# EAGLE schematic smarty07 (EAGLE 6.5.0)
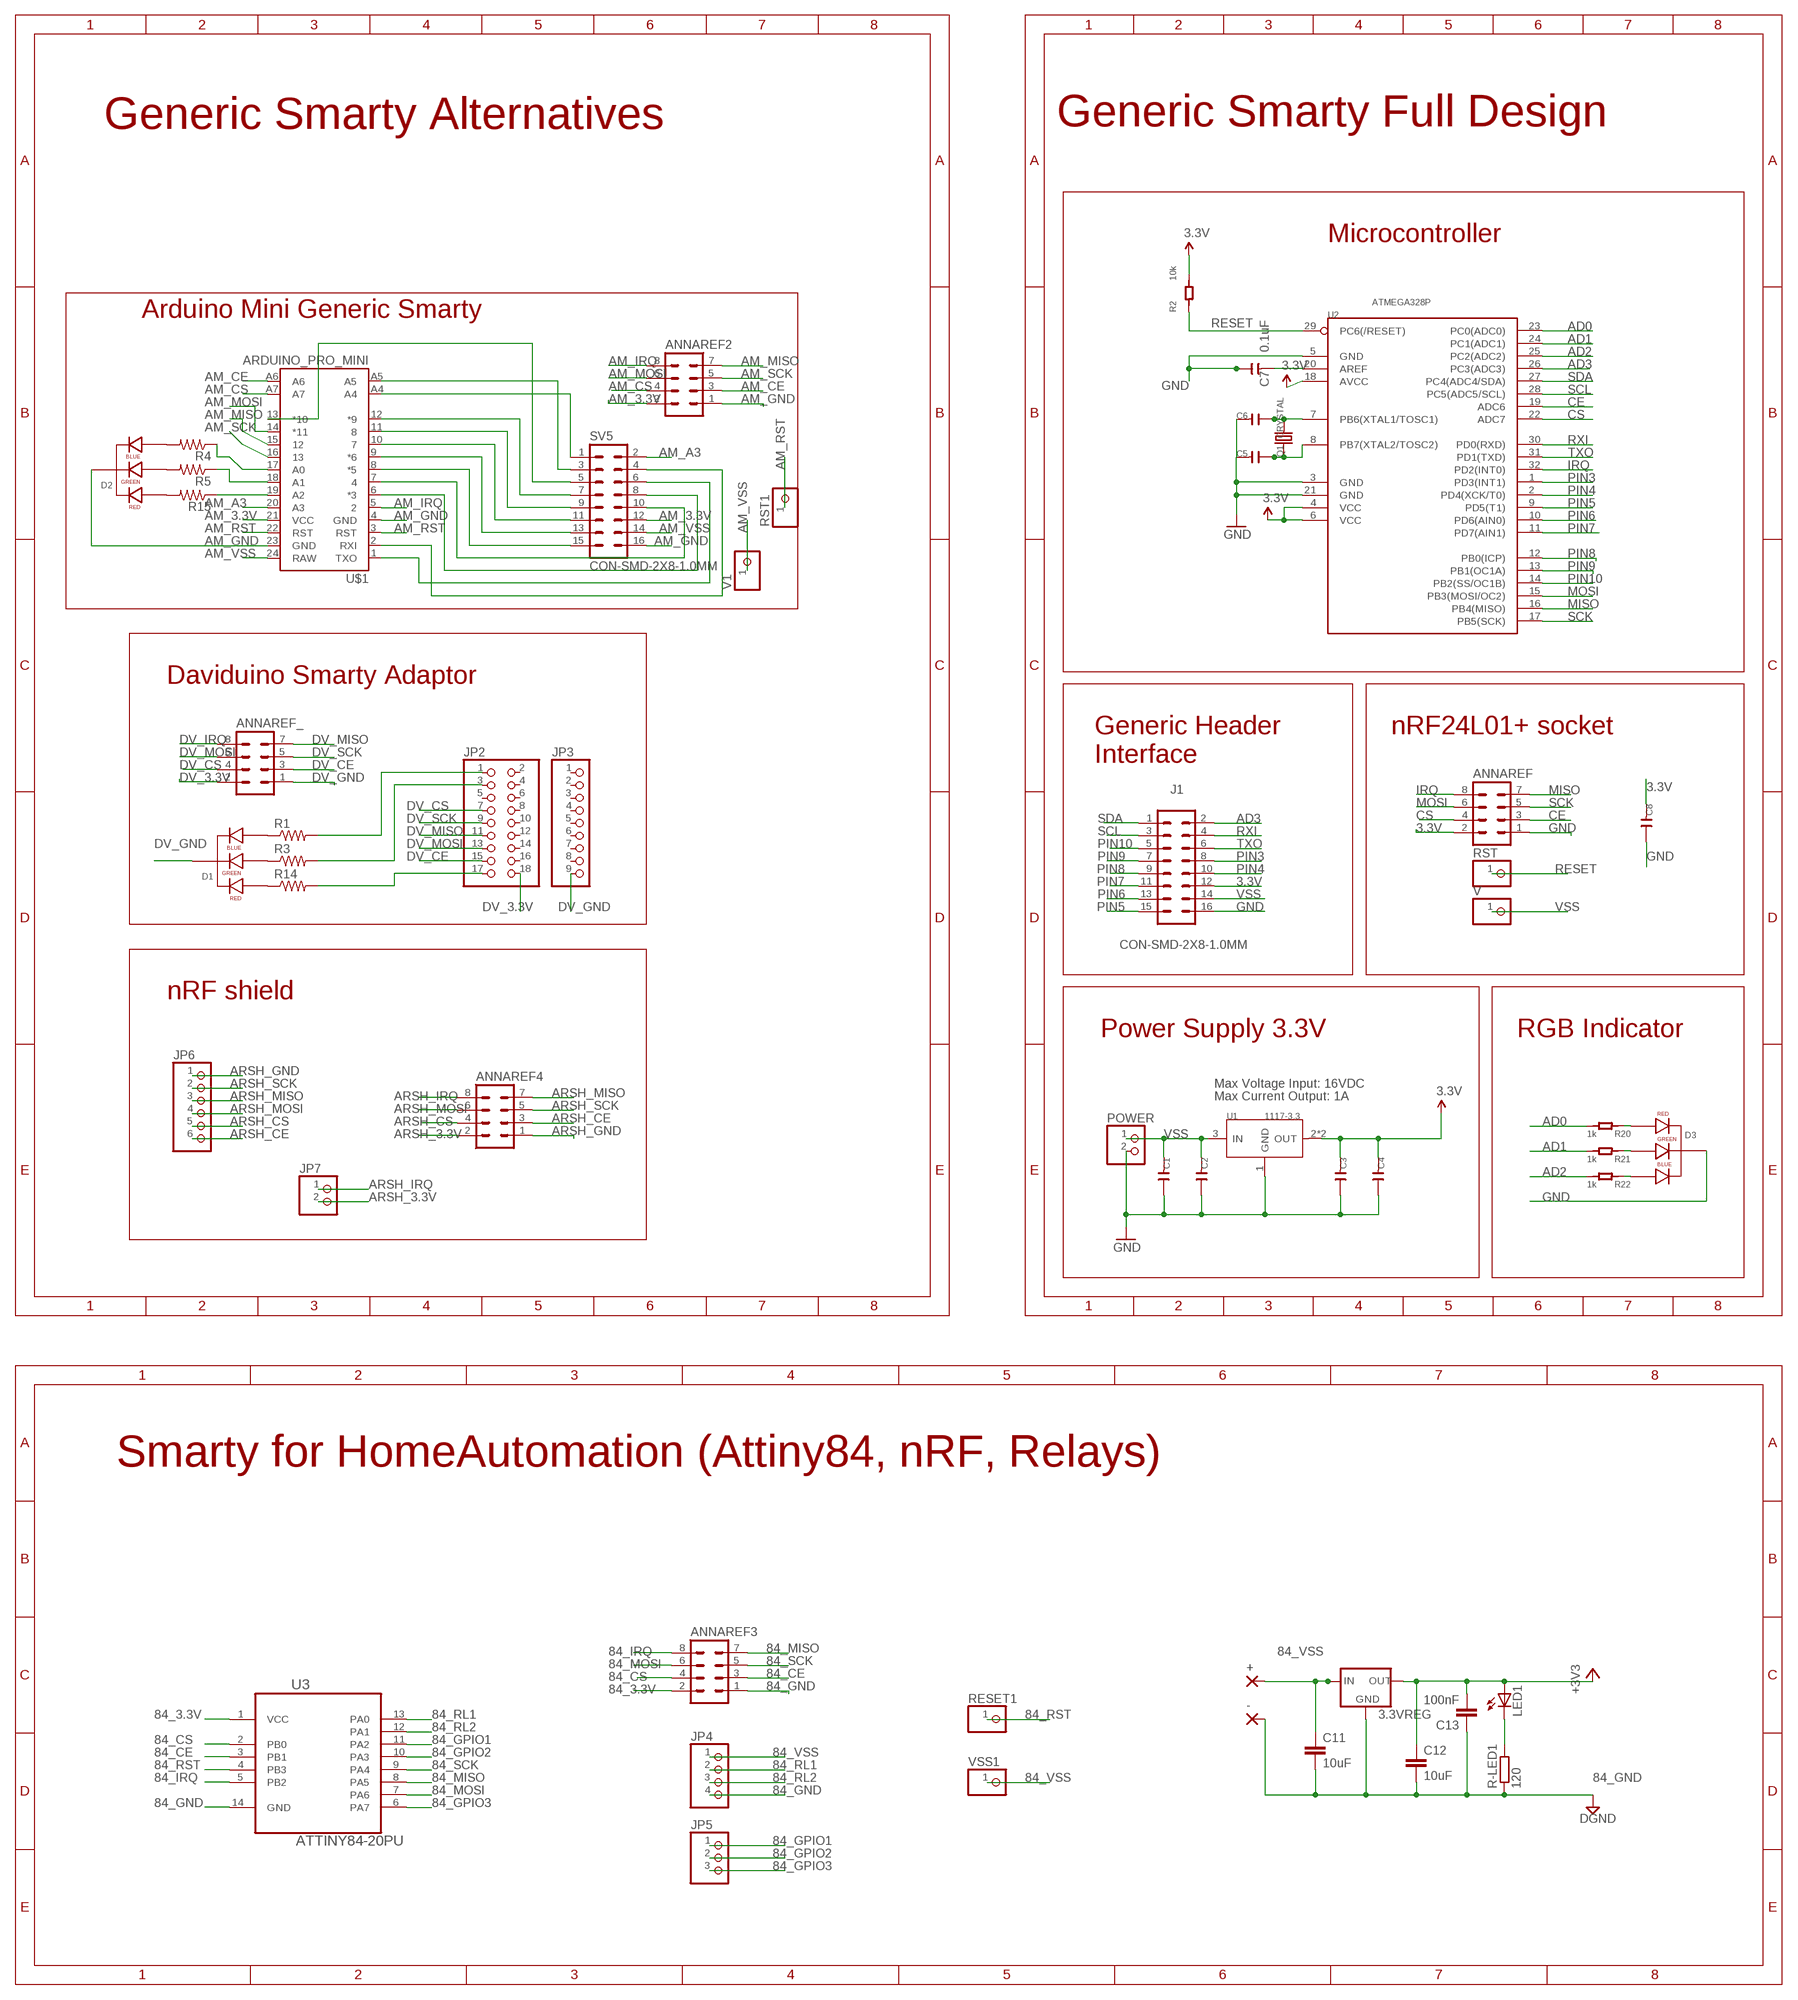
[diagram p0: schematic, sheet 1, part 1 of 2]
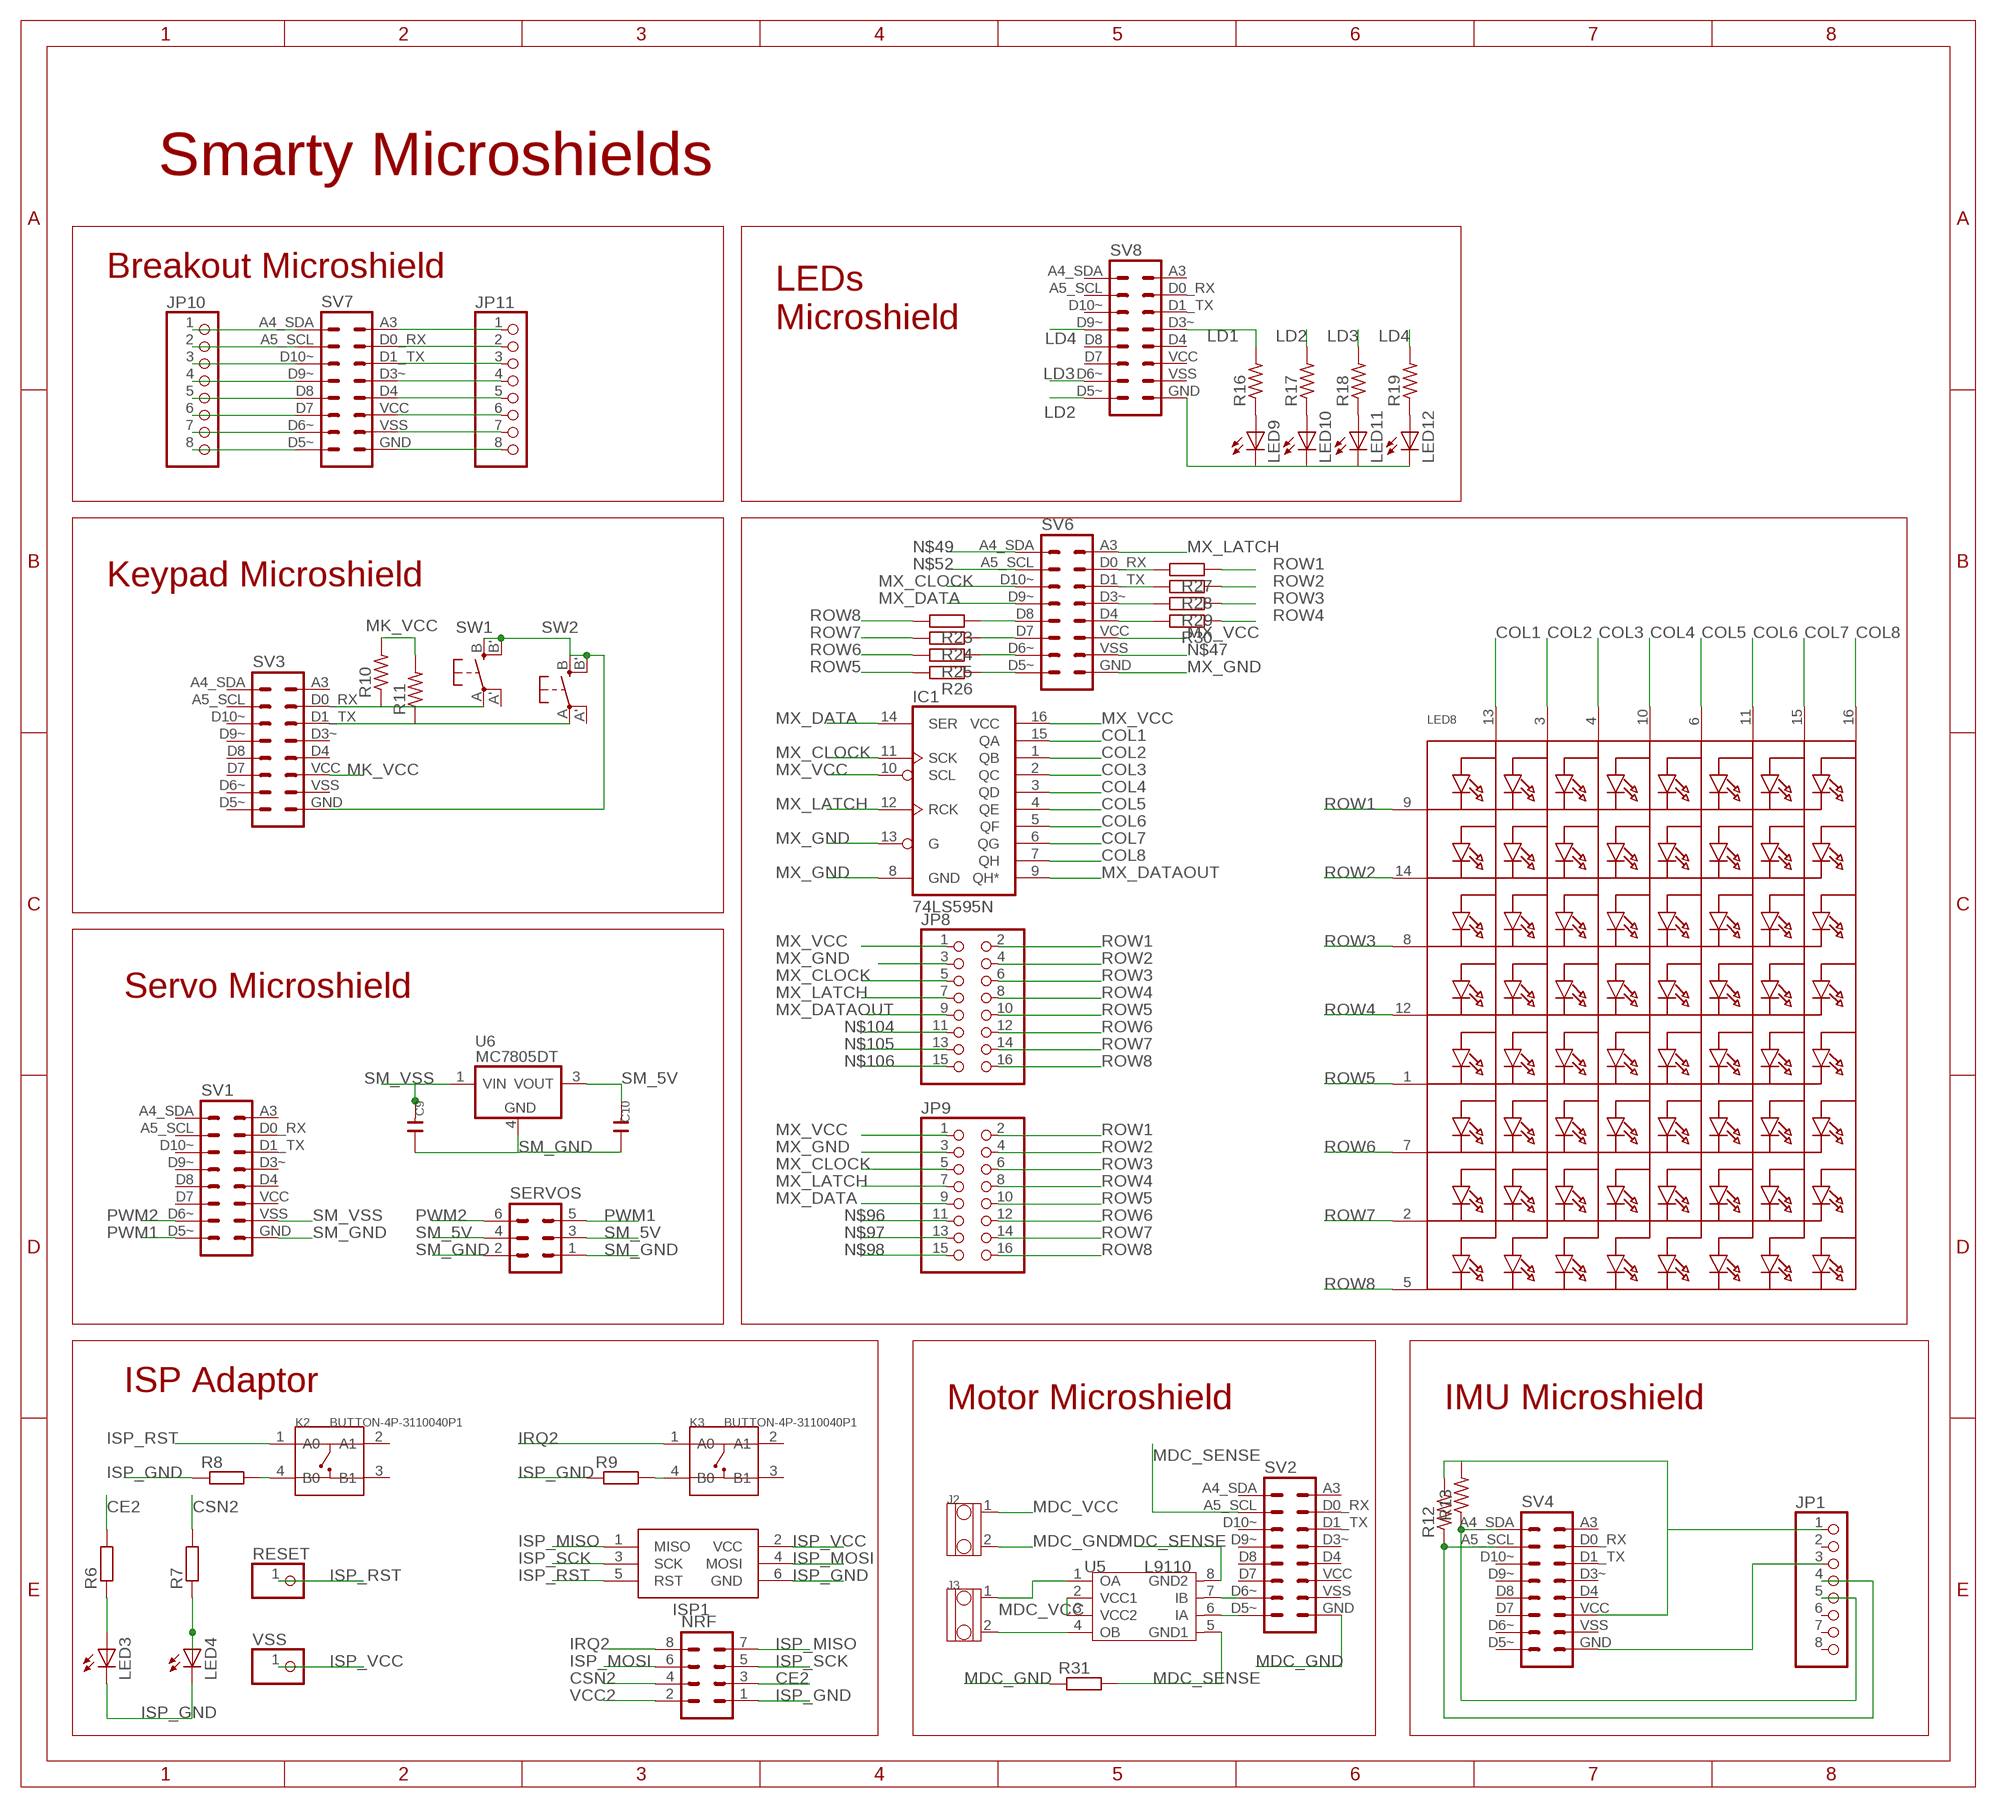
[diagram p1: schematic, sheet 1, part 2 of 2]

## Parts
3.3VREG  78LXX  [78LXX]
+  2,54/1,1  [2,54/1,1]
-  2,54/1,1  [2,54/1,1]
ANNAREF  MA04-2  [MA04-2]
ANNAREF2  MA04-2  [MA04-2]
ANNAREF3  MA04-2  [MA04-2]
ANNAREF4  MA04-2  [MA04-2]
ANNAREF_  MA04-2  [MA04-2]
C1  C-0603  [C0603]
C2  C-0805  [C0805]
C3  C-0603  [C0603]
C4  C-0805  [C0805]
C5  C-0603  [C0603]
C6  C-0603  [C0603]
C7  0.1uF  C-0805  [C0805]
C8  C-0805  [C0805]
C9  C-0805  [C0805]
C10  C-0805  [C0805]
C11  10uF  C-EU025-050X050  [C025-050X050]
C12  10uF  C-EU025-050X050  [C025-050X050]
C13  100nF  C-EU050-024X044  [C050-024X044]
D1  LED-RGB-CC-THRUCLEAR  [LED-RGB-THRU]
D2  LED-RGB-CC-THRUCLEAR  [LED-RGB-THRU]
D3  LED-RGB-CC-THRUCLEAR  [LED-RGB-THRU]
IC1  74LS595N  [DIL16]
ISP1  AVRISP-6  [AVRISP]
J1  CON-SMD-2X8-1.0MM  [SMRT-FEM-16]
J2  SCREW-TERMINAL-2P-3470110P1  [2P-5.0]
J3  SCREW-TERMINAL-2P-3470110P1  [2P-5.0]
JP1  PINHD-1X8BIG  [1X08-BIG]
JP2  PINHD-2X9-BIG  [2X09-BIG]
JP3  PINHD-1X9  [1X09-BIG]
JP4  PINHD-1X4  [1X04]
JP5  PINHD-1X3  [1X03]
JP6  PINHD-1X6  [1X06]
JP7  PINHD-1X2  [1X02]
JP8  PINHD-2X8  [2X08]
JP9  PINHD-2X8  [2X08]
JP10  PINHD-1X8  [1X08]
JP11  PINHD-1X8  [1X08]
K2  BUTTON-4P-3110040P1  [4P-6.0X6.0X5.0H]
K3  BUTTON-4P-3110040P1  [4P-6.0X6.0X5.0H]
LED1  LED3MM  [LED3MM]
LED3  LED3MM  [LED3MM]
LED4  LED3MM  [LED3MM]
LED8  SEGMENT_8X8_ROWCATHODEM12A881UR  [SEGMENT_BL-M12A881UR]
LED9  LEDCHIP-LED0603  [CHIP-LED0603]
LED10  LEDCHIP-LED0603  [CHIP-LED0603]
LED11  LEDCHIP-LED0603  [CHIP-LED0603]
LED12  LEDCHIP-LED0603  [CHIP-LED0603]
NRF  MA04-2  [MA04-2]
POWER  PINHD-1X2  [1X02]
Q1  CRYSTAL  CRYSTAL-0500290P1  [2P-SMD-5.0X3.2]
R1  R-US_0204/2V  [0204V]
R2  10k  R-0603  [R0603]
R3  R-US_0204/2V  [0204V]
R4  R-US_0207/2V  [0207/2V]
R5  R-US_0207/2V  [0207/2V]
R6  R-EU_0204/2V  [0204V]
R7  R-EU_0204/2V  [0204V]
R8  R-EU_0204/2V  [0204V]
R9  R-EU_0204/2V  [0204V]
R10  R-US_R0603  [R0603]
R11  R-US_R0603  [R0603]
R12  R-US_R0603  [R0603]
R13  R-US_R0603  [R0603]
R14  R-US_0204/2V  [0204V]
R15  R-US_0207/2V  [0207/2V]
R16  R-US_R0603  [R0603]
R17  R-US_R0603  [R0603]
R18  R-US_R0603  [R0603]
R19  R-US_R0603  [R0603]
R20  1k  R-0603  [R0603]
R21  1k  R-0603  [R0603]
R22  1k  R-0603  [R0603]
R23  R-EU_R0603  [R0603]
R24  R-EU_R0603  [R0603]
R25  R-EU_R0603  [R0603]
R26  R-EU_R0603  [R0603]
R27  R-EU_R0603  [R0603]
R28  R-EU_R0603  [R0603]
R29  R-EU_R0603  [R0603]
R30  R-EU_R0603  [R0603]
R31  R-EU_R1206  [R1206]
R-LED1  120  R-EU_0204/2V  [0204V]
RESET  PINHD-1X1  [1X01]
RESET1  PINHD-1X1  [1X01]
RST  PINHD-1X1  [1X01]
RST1  PINHD-1X1  [1X01]
SERVOS  MA03-2  [MA03-2]
SV1  MA08-2  [MA08-2]
SV2  MA08-2  [MA08-2]
SV3  MA08-2  [MA08-2]
SV4  MA08-2  [MA08-2]
SV5  CON-SMD-2X8-1.0MM  [SMRT-FEM-16]
SV6  MA08-2  [MA08-2]
SV7  MA08-2  [MA08-2]
SV8  MA08-2  [MA08-2]
SW1  SPST_TACT-EVQQ2  [EVQ-Q2]
SW2  SPST_TACT-EVQQ2  [EVQ-Q2]
U1  1117-3.3  CJ1117-3.3-1310120P1  [SOT89]
U2  ATMEGA328P  ATMEGA328P-AU-1030060P1  [TQFP32]
U3  ATTINY84-20PU  [DIP254P762X533-14]
U5  L9110  L9110-SOIC8  [SOIC8]
U6  MC7805DT  [DPAK-3]
U$1  ARDUINO_PRO_MINI  [ARDUINO_PRO_MINI]
V  PINHD-1X1  [1X01]
V1  PINHD-1X1  [1X01]
VSS  PINHD-1X1  [1X01]
VSS1  PINHD-1X1  [1X01]

## Nets
3.3V [power]: ANNAREF.2 C3.1 C4.1 C8.1 J1.12(VCC) R2.2 U1.2(OUT) U1.4(OUT) U2.4(VCC) U2.6(VCC) U2.18(AVCC)
84_3.3V [power]: ANNAREF3.2 U3.1(VCC)
84_3V3: 3.3VREG.OUT C12.1 C13.2 LED1.A ; supply symbol labelled +3V3
84_CE: ANNAREF3.3 U3.3(PB1)
84_CS: ANNAREF3.4 U3.2(PB0)
84_GND [power]: 3.3VREG.GND -.1(P) ANNAREF3.1 C11.2 C12.2 C13.1 JP4.4 R-LED1.1 U3.14(GND) ; supply symbol labelled DGND
84_GPIO1: JP5.1 U3.11(PA2)
84_GPIO2: JP5.2 U3.10(PA3)
84_GPIO3: JP5.3 U3.6(PA7)
84_IRQ: ANNAREF3.8 U3.5(PB2)
84_MISO: ANNAREF3.7 U3.8(PA5)
84_MOSI: ANNAREF3.6 U3.7(PA6)
84_RL1: JP4.2 U3.13(PA0)
84_RL2: JP4.3 U3.12(PA1)
84_RST: RESET1.1 U3.4(PB3)
84_SCK: ANNAREF3.5 U3.9(PA4)
84_VSS: 3.3VREG.IN +.1(P) C11.1 JP4.1 VSS1.1
AD0: R20.2 U2.23(PC0(ADC0))
AD1: R21.2 U2.24(PC1(ADC1))
AD2: R22.2 U2.25(PC2(ADC2))
AD3: J1.2(A3) U2.26(PC3(ADC3))
AM_3.3V [power]: ANNAREF2.2 SV5.12(VCC) U$1.21(VCC)
AM_A3: SV5.2(A3) U$1.20(A3)
AM_CE: ANNAREF2.3 U$1.A6
AM_CS: ANNAREF2.4 U$1.A7
AM_GND [power]: ANNAREF2.1 D2.2(CATHODE) SV5.16(GND) U$1.4(GND) U$1.23(GND)
AM_IRQ: ANNAREF2.8 U$1.5
AM_MISO: ANNAREF2.7 U$1.15
AM_MOSI: ANNAREF2.6 U$1.14(*11)
AM_RST: RST1.1 U$1.3(RST) U$1.22(RST)
AM_SCK: ANNAREF2.5 U$1.16
AM_VSS [power]: SV5.14(VSS) U$1.24(RAW) V1.1
ARSH_3.3V [power]: ANNAREF4.2 JP7.2
ARSH_CE: ANNAREF4.3 JP6.6
ARSH_CS: ANNAREF4.4 JP6.5
ARSH_GND [power]: ANNAREF4.1 JP6.1
ARSH_IRQ: ANNAREF4.8 JP7.1
ARSH_MISO: ANNAREF4.7 JP6.3
ARSH_MOSI: ANNAREF4.6 JP6.4
ARSH_SCK: ANNAREF4.5 JP6.2
CE: ANNAREF.3 U2.19(ADC6)
CE2: NRF.3 R6.2
COL1: IC1.15(QA) LED8.13(A1)
COL2: IC1.1(QB) LED8.3(A2)
COL3: IC1.2(QC) LED8.4(A3)
COL4: IC1.3(QD) LED8.10(A4)
COL5: IC1.4(QE) LED8.6(A5)
COL6: IC1.5(QF) LED8.11(A6)
COL7: IC1.6(QG) LED8.15(A7)
COL8: IC1.7(QH) LED8.16(A8)
CS: ANNAREF.4 U2.22(ADC7)
CSN2: NRF.4 R7.2
DV_3.3V [power]: ANNAREF_.2 JP2.18
DV_CE: ANNAREF_.3 JP2.15
DV_CS: ANNAREF_.4 JP2.7
DV_GND [power]: ANNAREF_.1 D1.2(CATHODE) JP3.9
DV_IRQ: ANNAREF_.8
DV_MISO: ANNAREF_.7 JP2.11
DV_MOSI: ANNAREF_.6 JP2.13
DV_SCK: ANNAREF_.5 JP2.9
GND [power]: ANNAREF.1 C1.2 C2.2 C3.2 C4.2 C5.1 C6.1 C7.2 C8.2 D3.2(CATHODE) J1.16(GND) POWER.2 U1.1(GND) U2.3(GND) U2.5(GND) U2.21(GND)
IA: SV2.D5~ U5.6(IA)
IB: SV2.D6~ U5.7(IB)
IRQ: ANNAREF.8 U2.32(PD2(INT0))
IRQ2: K3.1(A0) NRF.8
ISP_GND: ISP1.6(GND) LED3.K(C) LED4.K(C) NRF.1 R8.1 R9.1
ISP_MISO: ISP1.1(MISO) NRF.7
ISP_MOSI: ISP1.4(MOSI) NRF.6
ISP_RST: ISP1.5(RST) K2.1(A0) RESET.1
ISP_SCK: ISP1.3(SCK) NRF.5
ISP_VCC: ISP1.2(VCC) VSS.1
LD1: R16.2 SV8.D3~
LD2: R17.2 SV8.D5~
LD3: R18.2 SV8.D6~
LD4: R19.2 SV8.D9~
MDC_GND: J2.2 R31.1 SV2.GND
MDC_SENSE: R31.2 SV2.A5_SCL U5.5(GND1) U5.8(GND2)
MDC_VCC: J2.1 U5.2(VCC1) U5.3(VCC2)
MISO: ANNAREF.7 U2.16(PB4(MISO))
MK_VCC: R10.2 R11.2 SV3.VCC
MOSI: ANNAREF.6 U2.15(PB3(MOSI/OC2))
MX_CLOCK: IC1.11(SCK) JP8.5 JP9.5 SV6.D10~
MX_DATA: IC1.14(SER) JP9.9 SV6.D9~
MX_DATAOUT: IC1.9(QH*) JP8.9
MX_GND: IC1.8(GND) IC1.13(G) JP8.3 JP9.3 SV6.GND
MX_LATCH: IC1.12(RCK) JP8.7 JP9.7 SV6.A3
MX_VCC: IC1.10(SCL) IC1.16(VCC) JP8.1 JP9.1 SV6.VCC
N$1: C7.1 U2.20(AREF)
N$2: C6.2 Q1.2 U2.7(PB6(XTAL1/TOSC1))
N$3: J3.1 U5.1(OA)
N$4: C5.2 Q1.1 U2.8(PB7(XTAL2/TOSC2))
N$5: J3.2 U5.4(OB)
N$6: SV5.1(A4_SDA) U$1.A4
N$7: SV5.3(A5_SCL) U$1.A5
N$8: K3.4(B0) R9.2
N$9: K2.4(B0) R8.2
N$10: LED3.A R6.1
N$11: LED4.A R7.1
N$12: D1.4(BLUE_CATHODE) R1.1
N$13: D1.3(GREEN_CATHODE) R3.1
N$14: D1.1(RED_CATHODE) R14.1
N$15: JP2.17 R14.2
N$16: R10.1 SV3.D0_RX SW1.A(P)
N$17: R11.1 SV3.D1_TX SW2.A(P)
N$18: SV3.GND SW1.B'(S1) SW1.B(S) SW2.B'(S1) SW2.B(S)
N$19: JP1.1 R12.2 R13.2 SV4.VCC
N$20: JP1.3 SV4.GND
N$21: JP1.4 R12.1 SV4.A5_SCL
N$22: JP1.5 R13.1 SV4.A4_SDA
N$23: D2.4(BLUE_CATHODE) R4.2
N$24: R4.1 U$1.17(A0)
N$25: D2.3(GREEN_CATHODE) R5.2
N$26: JP2.3 R3.2
N$27: JP2.1 R1.2
N$28: JP10.1 SV7.A4_SDA
N$29: SV5.7(D9~) U$1.12(*9)
N$30: SV5.9(D8) U$1.11
N$31: SV5.11(D7) U$1.10
N$32: SV5.13(D6~) U$1.9(*6)
N$33: SV5.15(D5~) U$1.8(*5)
N$34: SV5.10(D4) U$1.7
N$35: SV5.8(D3~) U$1.6(*3)
N$36: SV5.5(D10~) U$1.13(*10)
N$37: SV5.6(D1_TX) U$1.1(TXO)
N$38: SV5.4(D0_RX) U$1.2(RXI)
N$39: R5.1 U$1.18(A1)
N$40: D2.1(RED_CATHODE) R15.2
N$41: JP10.2 SV7.A5_SCL
N$42: D3.1(RED_CATHODE) R20.1
N$43: JP10.3 SV7.D10~
N$44: JP10.4 SV7.D9~
N$45: JP10.5 SV7.D8
N$46: JP10.6 SV7.D7
N$47: SV6.VSS
N$48: JP10.7 SV7.D6~
N$49: SV6.A4_SDA
N$50: R15.1 U$1.19(A2)
N$51: LED1.K(C) R-LED1.2
N$52: SV6.A5_SCL
N$53: JP10.8 SV7.D5~
N$54: JP11.1 SV7.A3
N$55: JP11.2 SV7.D0_RX
N$56: JP11.3 SV7.D1_TX
N$57: JP11.4 SV7.D3~
N$58: JP11.5 SV7.D4
N$59: JP11.6 SV7.VCC
N$60: JP11.7 SV7.VSS
N$61: JP11.8 SV7.GND
N$62: LED9.A R16.1
N$63: LED10.A R17.1
N$64: LED11.A R18.1
N$65: LED12.A R19.1
N$66: D3.3(GREEN_CATHODE) R21.1
N$67: D3.4(BLUE_CATHODE) R22.1
N$68: LED9.C LED10.C LED11.C LED12.C SV8.GND
N$69: R23.1 SV6.D8
N$70: R24.1 SV6.D7
N$71: R25.1 SV6.D6~
N$72: R26.1 SV6.D5~
N$73: R27.2 SV6.D0_RX
N$74: R28.2 SV6.D1_TX
N$75: R29.2 SV6.D3~
N$76: R30.2 SV6.D4
N$96: JP9.11
N$97: JP9.13
N$98: JP9.15
N$104: JP8.11
N$105: JP8.13
N$106: JP8.15
PIN3: J1.8(D3~) U2.1(PD3(INT1))
PIN4: J1.10(D4) U2.2(PD4(XCK/T0))
PIN5: J1.15(D5~) U2.9(PD5(T1))
PIN6: J1.13(D6~) U2.10(PD6(AIN0))
PIN7: J1.11(D7) U2.11(PD7(AIN1))
PIN8: J1.9(D8) U2.12(PB0(ICP))
PIN9: J1.7(D9~) U2.13(PB1(OC1A))
PIN10: J1.5(D10~) U2.14(PB2(SS/OC1B))
PWM1: SERVOS.5 SV1.D5~
PWM2: SERVOS.6 SV1.D6~
RESET: R2.1 RST.1 U2.29(PC6(/RESET))
ROW1: JP8.2 JP9.2 LED8.9(K1) R27.1
ROW2: JP8.4 JP9.4 LED8.14(K2) R28.1
ROW3: JP8.6 JP9.6 LED8.8(K3) R29.1
ROW4: JP8.8 JP9.8 LED8.12(K4) R30.1
ROW5: JP8.10 JP9.10 LED8.1(K5) R26.2
ROW6: JP8.12 JP9.12 LED8.7(K6) R25.2
ROW7: JP8.14 JP9.14 LED8.2(K7) R24.2
ROW8: JP8.16 JP9.16 LED8.5(K8) R23.2
RXI: J1.4(D0_RX) U2.30(PD0(RXD))
SCK: ANNAREF.5 U2.17(PB5(SCK))
SCL: J1.3(A5_SCL) U2.28(PC5(ADC5/SCL))
SDA: J1.1(A4_SDA) U2.27(PC4(ADC4/SDA))
SM_5V: C10.1 SERVOS.3 SERVOS.4 U6.3(VOUT)
SM_GND: C9.2 C10.2 SERVOS.1 SERVOS.2 SV1.GND U6.4(GND)
SM_VSS [power]: C9.1 SV1.VSS U6.1(VIN)
TXO: J1.6(D1_TX) U2.31(PD1(TXD))
VCC2: NRF.2
VSS [power]: C1.1 C2.1 J1.14(VSS) POWER.1 U1.3(IN) V.1
Unconnected: JP1.2 JP1.6 JP1.7 JP1.8 JP2.2 JP2.4 JP2.5 JP2.6 JP2.8 JP2.10 JP2.12 JP2.14 JP2.16 JP3.1 JP3.2 JP3.3 JP3.4 JP3.5 JP3.6 JP3.7 JP3.8 K2.2(A1) K2.3(B1) K3.2(A1) K3.3(B1) SV1.A3 SV1.A4_SDA SV1.A5_SCL SV1.D0_RX SV1.D1_TX SV1.D3~ SV1.D4 SV1.D7 SV1.D8 SV1.D9~ SV1.D10~ SV1.VCC SV2.A3 SV2.A4_SDA SV2.D0_RX SV2.D1_TX SV2.D3~ SV2.D4 SV2.D7 SV2.D8 SV2.D9~ SV2.D10~ SV2.VCC SV2.VSS SV3.A3 SV3.A4_SDA SV3.A5_SCL SV3.D3~ SV3.D4 SV3.D5~ SV3.D6~ SV3.D7 SV3.D8 SV3.D9~ SV3.D10~ SV3.VSS SV4.A3 SV4.D0_RX SV4.D1_TX SV4.D3~ SV4.D4 SV4.D5~ SV4.D6~ SV4.D7 SV4.D8 SV4.D9~ SV4.D10~ SV4.VSS SV8.A3 SV8.A4_SDA SV8.A5_SCL SV8.D0_RX SV8.D1_TX SV8.D4 SV8.D7 SV8.D8 SV8.D10~ SV8.VCC SV8.VSS SW1.A'(P1) SW2.A'(P1)

## Notes on the sheet
- Generic Smarty Alternatives | Generic Smarty Full Design | Smarty Microshields
- Breakout Microshield
- Microcontroller
- LEDs
  Microshield
- Arduino Mini Generic Smarty
- Keypad Microshield
- Daviduino Smarty Adaptor
- nRF24L01+ socket | Servo Microshield
- Generic Header
  Interface
- nRF shield
- ISP Adaptor
- Power Supply 3.3V | RGB Indicator | Motor Microshield | IMU Microshield
- Max Voltage Input: 16VDC
- Max Current Output: 1A
- Smarty for HomeAutomation (Attiny84, nRF, Relays)

## Library data of the parts
3.3VREG = v-reg:78LXX: VOLTAGE REGULATOR
+ - = wirepad:2,54/1,1: THROUGH-HOLE PAD
ANNAREF ANNAREF2-ANNAREF4 ANNAREF_ NRF = con-lstb:MA04-2: PIN HEADER; OC_FARNELL: unknown; OC_NEWARK: unknown
C1-C10 = OPL:C*
C11-C13 = rcl:C-EU: CAPACITOR, European symbol
D1-D3 = smarties:LED-RGB-CC-THRU: RGB Through-hole common cathode LED SparkFun Storefront: COM-00105 (Clear) COM-09264 (Diffuse); PROD_ID: DIO-08418
IC1 = SparkFun-DigitalIC:74*595: 8-bit SHIFT REGISTER, output latch
ISP1 = adafruit:AVRISP: AVR ISP HEADER Standard 6 pin header for AVR programming
J1 SV5 = smarties:CON-SMD-2X8-1.0MM: HEADER - Vertical, Shrouded
J2 J3 = OPL:SCREW-TERMINAL-2P
JP1 = adafruit:PINHD-1X8: PIN HEADER
JP2 = adafruit:PINHD-2X9: PIN HEADER With larger annulars
JP3 = adafruit:PINHD-1X9: Pin header 1x10 0.1" spacing With round pins
JP4 = pinhead:PINHD-1X4: PIN HEADER
JP5 = pinhead:PINHD-1X3: PIN HEADER
JP6 = pinhead:PINHD-1X6: PIN HEADER
JP7 POWER = pinhead:PINHD-1X2: PIN HEADER
JP8 JP9 = pinhead:PINHD-2X8: PIN HEADER
JP10 JP11 = pinhead:PINHD-1X8: PIN HEADER
K2 K3 = OPL:BUTTON-4P
LED1 LED3 LED4 = led:LED: LED
LED8 = smarties:SEGMENT_8X8_ROWCATHODE: 8x8 LED Segment Displays: Row = Cathode 0.7" Red 8X8 Matrix, 1.9mm Round LEDs - BL-M07C881UR 1.2" Red 8x8 Matrix, 3.0mm Round LEDs - BL-M12A881UR 1.2" Red 8x8 Matrix, 3.0mm Square LEDs - BL-M12A883
LED9-LED12 = adafruit:LED: LED
Q1 = OPL:CRYSTAL*
R1 R3-R5 R14 R15 = resistor:R-US_: RESISTOR, American symbol
R2 R20-R22 = OPL:R*
R6-R9 = rcl:R-EU_: RESISTOR, European symbol
R10-R13 R16-R19 = adafruit:R-US_: RESISTOR, American symbol
R23-R31 R-LED1 = resistor:R-EU_: RESISTOR, European symbol
RESET RESET1 RST RST1 V V1 VSS VSS1 = pinhead:PINHD-1X1: PIN HEADER
SERVOS = con-lstb:MA03-2: PIN HEADER; OC_FARNELL: unknown; OC_NEWARK: unknown
SV1-SV4 SV6-SV8 = smarties:MA08-2: PIN HEADER; OC_FARNELL: unknown; OC_NEWARK: unknown
SW1 SW2 = adafruit:SPST_TACT: SMT 6mm switch, EVQQ2 series http://www.ladyada.net/library/eagle
U1 = OPL:CJ1117-3.3: 1A Low Dropout Linear Regulator
U2 = OPL:ATMEGA328P-AU: 8-bit AVR Microcontroller with 32K Bytes In-System Programmable Flash
U3 = Atmel_By_element14_Batch_1-00:ATTINY84-20PU: 8-bit Microcontroller with In-System Programmable Flash; MPN: ATTINY84-20PU; OC_FARNELL: -; OC_NEWARK: 58M3794; PACKAGE: PDIP-14; SUPPLIER: Atmel
U5 = con-1.0mm:L9110: Motor Driver
U6 = _hhn_78xx_79xx_NCV78xx_d2pak_dpak:MC78*: 78xx SMD (D2PAK, DPAK) (MC)78xx..DT (DPAK-3; Rth,JA = 92 K/W) (MC)78xx..D2T (D2PAK-3; Rth,JA = 45 K/W @ 10x10mm copper area) Linear Voltage Regulators, Positive, 1 A (ON Semiconductor) Package dimenisions and soldering footprints acc. to ONSEMI specs. Source: http://onsemi.com Datasheet document#: MC7800/D Technologies: 78xxyD(2)Tz: xx = Output Voltage (V) y, z: additional suffixes see manufacturer's datasheet Author: Dipl.-Ing. FH Rainer Bayer HHN Hochschule Heilbronn, rainer.bayer@hs-heilbronn.de Ingenieurbüro ing-rb, mail@ing-rb.de
U$1 = smarties:ARDUINO_PRO_MINI

## Net classes
0 default: width 0.203 mm, drill 0.203 mm, clearance 0.152 mm
1 power: width 0.254 mm, drill 0.406 mm, clearance 0.152 mm
2 thnet: width 0.203 mm, drill 0.203 mm, clearance 0.305 mm